# Altium schematic sheet SH-C31A-V1.1.SchDoc
size 420 x 298 mm; Symbol: Sheet-Symbol_A3; Company: DSD TECH; @Page No: 1; @Page Name: P1; @Project Name: CANable; @Page Count: 1; @Update Date: 2023-06-07; @Create Date: 2023-04-24; @Schematic Name: CANable2.0_V1.1; Device: Sheet-Symbol_A3
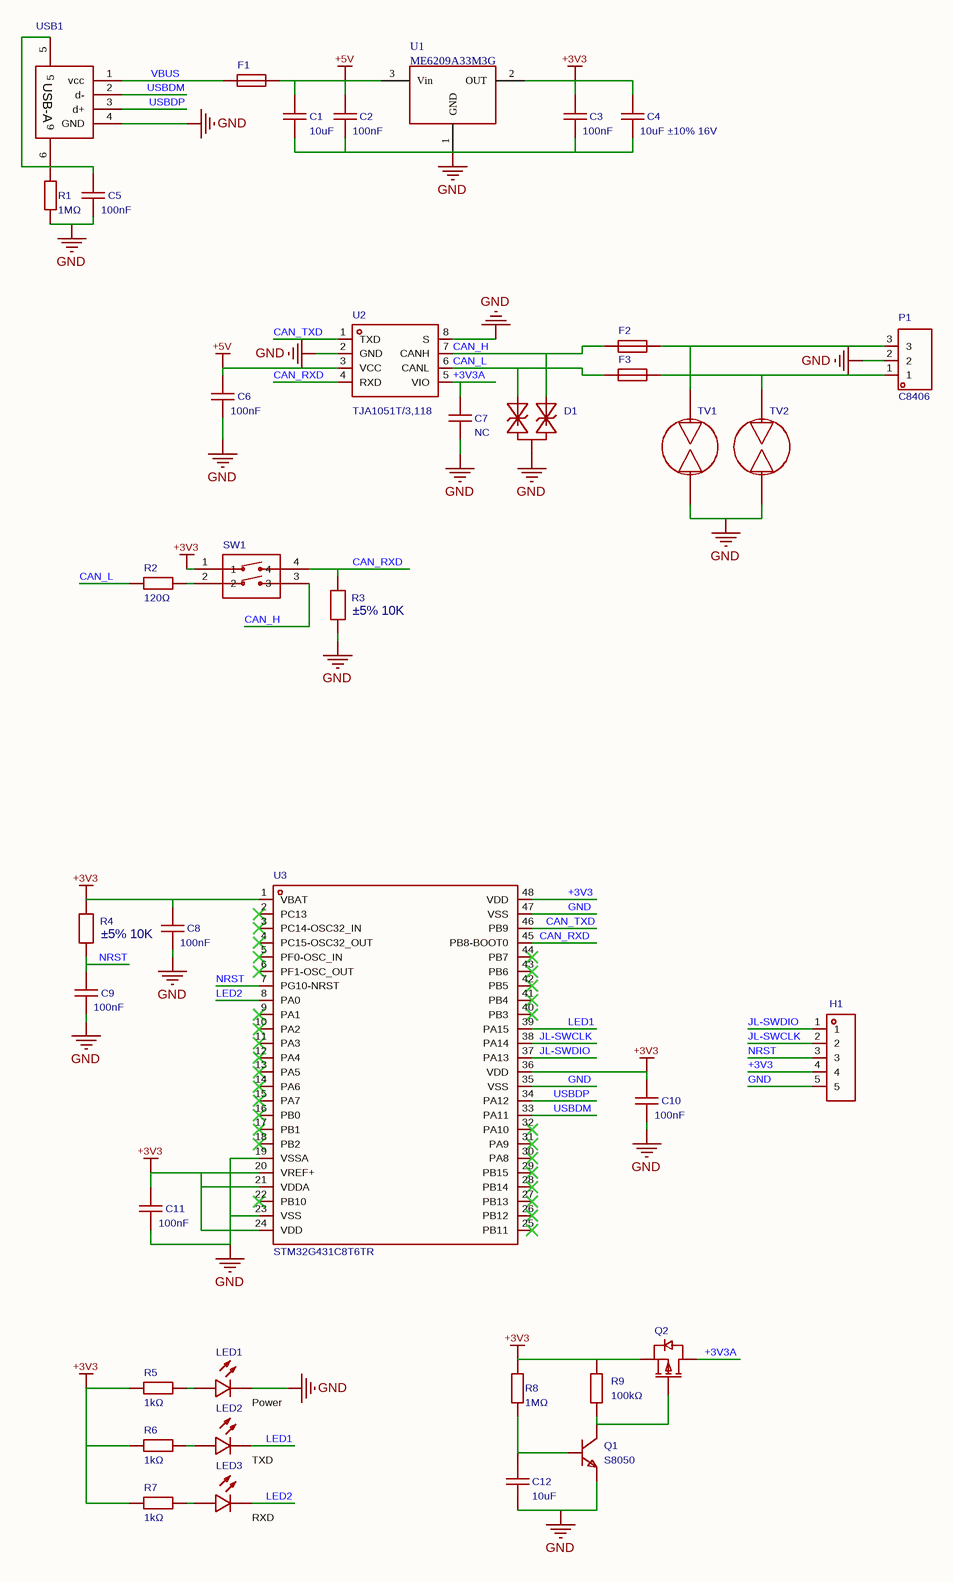
[diagram p0: SH-C31A-V1.1.SchDoc]

## Parts
C1  10uF  [C0805_1]
C2  100nF  [C0402_2]
C3  100nF  [C0402_2]
C4  LCSC Part Name: 10uF ±10% 16V  [C0805_1]  (hidden comment: 10uF)
C5  100nF  [C0402_2]
C6  100nF  [C0402_2]
C7  NC  [C0402_2]
C8  100nF  [C0402_2]
C9  100nF  [C0402_2]
C10  100nF  [C0402_2]
C11  100nF  [C0402_2]
C12  10uF  [C0603_1]
D1  (no value)  [SOT-23-3_L2.9-W1.3-P1.90-LS2.4-BR]
F1  (no value)  [F0805]
F2  SMD1206B020TF/24  [F1206_1]  (value not drawn)
F3  SMD1206B020TF/24  [F1206_1]  (value not drawn)
H1  (no value)  [HDR-TH_5P-P2.54-V-M]
LED1  (no value)  [LED0603-RD_RED_1]
LED2  (no value)  [LED0603-RD]
LED3  (no value)  [LED0603-RD]
P1  Supplier Part: C8406  [CONN-TH_3P-P3.81_WJ15EDGRC-3.81-3P]  (hidden comment: WJ15EDGRC-3.81-3P)
Q1  S8050  [SOT-23_L2.9-W1.3-P1.90-LS2.4-BR]
Q2  SI2301  [SOT-23-3_L2.9-W1.3-P1.90-LS2.4-BR_2]  (value not drawn)
R1  value 1MΩ  [R0603]
R2  value 120Ω  [R0805]
R3  LCSC Part Name: ±5% 10K  [R0402]
R4  LCSC Part Name: ±5% 10K  [R0402]
R5  value 1kΩ  [R0402]
R6  value 1kΩ  [R0402]
R7  value 1kΩ  [R0402]
R8  value 1MΩ  [R0603]
R9  100kΩ  [R0603]
SW1  (no value)  [SW-SMD_4P-L6.5-W6.0-P2.54-LS9.8]
TV1  (no value)  [DIO-DT-SMD_L4.5-W3.2]
TV2  (no value)  [DIO-DT-SMD_L4.5-W3.2]
U1  ME6209A33M3G  [SOT-23(SOT-23-3)]
U2  TJA1051T/3,118  [SOIC-8_L4.9-W3.9-P1.27-LS6.0-BL]
U3  STM32G431C8T6TR  [LQFP-48_L7.0-W7.0-P0.50-LS9.0-BL_1]
USB1  (no value)  [USB-A-SMD_U-G-04WS-W-01]

## Nets
+3V3: C3.2 C4.2 C8.2 C10.2 C11.2 H1.4 Q2.2(S) R4.2 R5.1 R6.1 R7.1 R8.2 R9.2 SW1.1 U1.2(OUT) U3.1(VBAT) U3.20(VREF+) U3.21(VDDA) U3.24(VDD) U3.36(VDD) U3.48(VDD)
+5V: C1.2 C2.2 C6.2 F1.2 U1.3(Vin) U2.3(VCC)
GND: C1.1 C2.1 C3.1 C4.1 C5.1 C6.1 C7.1 C8.1 C9.1 C10.1 C11.1 C12.1 D1.3 H1.5 LED1.1(K) P1.2 Q1.2(E) R1.1 R3.1 TV1.2 TV2.2 U1.1(GND) U2.2(GND) U2.8(S) U3.19(VSSA) U3.23(VSS) U3.35(VSS) U3.47(VSS) USB1.4(GND)
+3V3A: C7.2 Q2.3(D) U2.5(VIO)
CAN_H: D1.1 F2.1 SW1.3 U2.7(CANH)
CAN_L: D1.2 F3.1 R2.1 U2.6(CANL)
CAN_RXD: R3.2 SW1.4 U2.4(RXD) U3.45(PB8-BOOT0)
CAN_TXD: U2.1(TXD) U3.46(PB9)
JL-SWCLK: H1.2 U3.38(PA14)
JL-SWDIO: H1.1 U3.37(PA13)
LED1: LED2.1(K) U3.39(PA15)
LED2: LED3.1(K) U3.8(PA0)
NRST: C9.2 H1.3 R4.1 U3.7(PG10-NRST)
USBDM: U3.33(PA11) USB1.2(d-)
USBDP: U3.34(PA12) USB1.3(d+)
VBUS: F1.1 USB1.1(vcc)
NetC5_2: C5.2 R1.2 USB1.5 USB1.6
NetC12_2: C12.2 Q1.1(B) R8.1
NetF2_2: F2.2 P1.3 TV1.1
NetF3_2: F3.2 P1.1 TV2.1
NetLED1_2: LED1.2(A) R5.2
NetLED2_2: LED2.2(A) R6.2
NetLED3_2: LED3.2(A) R7.2
NetQ1_3: Q1.3(C) Q2.1(G) R9.1
NetR2_2: R2.2 SW1.2

Not connected (* = marked no-connect by the designer): U3 2(PC13)* 3(PC14-OSC32_IN)* 4(PC15-OSC32_OUT)* 5(PF0-OSC_IN)* 6(PF1-OSC_OUT)* 9(PA1)* 10(PA2)* 11(PA3)* 12(PA4)* 13(PA5)* 14(PA6)* 15(PA7)* 16(PB0)* 17(PB1)* 18(PB2)* 22(PB10)* 25(PB11)* 26(PB12)* 27(PB13)* 28(PB14)* 29(PB15)* 30(PA8)* 31(PA9)* 32(PA10)* 40(PB3)* 41(PB4)* 42(PB5)* 43(PB6)* 44(PB7)*

## Notes on the sheet
- (near LED1) Power
- (near LED2) TXD
- (near LED3) RXD
- Update Date
- 2023-06-07
- Schematic
- Page
- CANable2.0_V1.1
- P1
- Create Date
- Part Number
- 2023-04-24
- Reviewed
- Drawed
- CANable
- VER
- SIZE
- PAGE
- 1
- DSD TECH
- OF
- (in symbol U-G-04WS-W-01) USB-A

## Library data of the parts
C1 C4 = CL21A106KOQNNNE: Capacitance:10uF;Tolerance:±10%;Rated Voltage:16V;Dielectric (Temp. Coefficient):X5R;; Manufacturer: SAMSUNG; AddInBom: yes; ModelId: 1ba041120af144c991958decab20d241; ModelName: C0805_L2.0-W1.3-H1.3; ModelTransform: 78.74,51.181,0,0,0,0,0,0.0005,0; Tolerance: ±10%; Voltage Rated: 16V; Temperature Coefficient: X5R; Symbol: CL21A106KOQNNNE; Value: 10uF; Device: CL21A106KOQNNNE; SupplierPart: C1713; ManufacturerPart: CL21A106KOQNNNE; Supplier Footprint: 0805; JLCPCB Part Class: Extended Part; Datasheet: https://atta.szlcsc.com/upload/public/pdf/source/20160103/1457707694240.pdf; Supplier: LCSC; ConvertToPcb: yes; FootprintName: C0805_1
  C1: LCSC Part Name: 10uF ±10% 16V
C2 C3 C5 C6 C8-C11 = 0402B104K250NT: Capacitance:100nF;Tolerance:±10%;Rated Voltage:25V;Dielectric (Temp. Coefficient):X7R;; Manufacturer: FH; AddInBom: yes; ModelId: 36a51122f27c49738f86b3bfa98863e0; ModelName: C0402_L1.0-W0.5-H0.5; ModelTransform: 39.37,19.685,0,0,0,0,0,0,0; Tolerance: ±10%; Voltage Rated: 25V; Temperature Coefficient: X7R; Symbol: 0402B104K250NT; Value: 100nF; Device: 0402B104K250NT; LCSC Part Name: 100nF ±10% 25V; SupplierPart: C56392; ManufacturerPart: 0402B104K250NT; Supplier Footprint: 0402; JLCPCB Part Class: Extended Part; Datasheet: https://atta.szlcsc.com/upload/public/pdf/source/20170923/C56392_1506149493292988842.pdf; Supplier: LCSC; ConvertToPcb: yes; FootprintName: C0402_2
C7 = 0402B104K250NT: Capacitance:100nF;Tolerance:±10%;Rated Voltage:25V;Dielectric (Temp. Coefficient):X7R;; Manufacturer: FH; Value: 100nF; AddInBom: yes; ModelId: 36a51122f27c49738f86b3bfa98863e0; ModelName: C0402_L1.0-W0.5-H0.5; ModelTransform: 39.37,19.685,0,0,0,0,0,0,0; Tolerance: ±10%; Voltage Rated: 25V; Temperature Coefficient: X7R; Symbol: 0402B104K250NT; Device: 0402B104K250NT; LCSC Part Name: 100nF ±10% 25V; SupplierPart: C56392; ManufacturerPart: 0402B104K250NT; Supplier Footprint: 0402; JLCPCB Part Class: Extended Part; Datasheet: https://atta.szlcsc.com/upload/public/pdf/source/20170923/C56392_1506149493292988842.pdf; Supplier: LCSC; ConvertToPcb: yes; FootprintName: C0402_2
C12 = CL10A106KP8NNNC: Capacitance:10uF;Tolerance:±10%;Rated Voltage:10V;Dielectric (Temp. Coefficient):X5R;; Manufacturer: SAMSUNG; AddInBom: yes; ModelId: ac125912035d415993ca9572d50418b1; ModelName: C0603_L1.6-W0.8-H0.8; ModelTransform: 62.992,31.496,0,0,0,0,0,0,0; Tolerance: ±10%; Voltage Rated: 10V; Temperature Coefficient: X5R; Symbol: CL10A106KP8NNNC; Value: 10uF; Device: CL10A106KP8NNNC; LCSC Part Name: 10uF ±10% 10V; SupplierPart: C19702; ManufacturerPart: CL10A106KP8NNNC; Supplier Footprint: 0603; JLCPCB Part Class: Basic Part; Datasheet: https://atta.szlcsc.com/upload/public/pdf/source/20160103/1457707703378.pdf; Supplier: LCSC; ConvertToPcb: yes; FootprintName: C0603_1
D1 = TPPESD12VL2BT: Manufacturer: TECH PUBLIC; AddInBom: yes; ModelId: c62791f0466c4ae2a892c056b845b0ca; ModelName: SOT-23-3P_L2.9-W1.3-H1.0-LS2.4-P0.95; ModelTransform: 98.425,114.173,0,180,0,0,0.0005,-0.0005,0; Symbol: TPPESD12VL2BT; Device: TPPESD12VL2BT; LCSC Part Name: TPPESD12VL2BT; SupplierPart: C2682273; ManufacturerPart: TPPESD12VL2BT; Supplier Footprint: SOT-23-3; JLCPCB Part Class: Extended Part; Datasheet: https://atta.szlcsc.com/upload/public/pdf/source/20210810/22D0EE7AE03C1C968B9C50DDF599EB08.pdf; Supplier: LCSC; ConvertToPcb: yes; FootprintName: SOT-23-3_L2.9-W1.3-P1.90-LS2.4-BR
F1 = FSMD010-24-0805-R: Max Voltage:24V;Max Current:100A;Hold Current:100mA;Trip Current:300mA;; Manufacturer: FUZETEC; AddInBom: yes; ModelId: 57e2aa106f9143e8b6ab832aebb31c78; ModelName: F0805_L2.1-W1.4-H0.8; ModelTransform: 82.677,55.118,0,0,0,0,0.0005,0,0; Operating Voltage (Max): 24V; Current Rating (Max): 100A; Hold Current: 100mA; Trip Current: 300mA; Symbol: FSMD010-24-0805-R; Device: FSMD010-24-0805-R; LCSC Part Name: 0.1A 24V resettable fuse; SupplierPart: C220142; ManufacturerPart: FSMD010-24-0805-R; Supplier Footprint: 0805; JLCPCB Part Class: Extended Part; Datasheet: https://atta.szlcsc.com/upload/public/pdf/source/20180530/C220142_CDCC5931C174CCAFFDB29D784E09FABB.PDF; Supplier: LCSC; ConvertToPcb: yes; FootprintName: F0805
F2 F3 = SMD1206B020TF/24: Max Voltage:24V;Max Current:100A;Hold Current:200mA;Trip Current:420mA;Max Trip Time:100ms;; Manufacturer: Brightking; AddInBom: yes; ModelId: f1628daad26847a79b887277a2bc8541; ModelName: F1206_L3.2-W1.7-H0.6; ModelTransform: 125.984,66.929,0,0,0,0,0,0,0; Operating Voltage (Max): 24V; Current Rating (Max): 100A; Hold Current: 200mA; Trip Current: 420mA; Maximum Time to Trip: 100ms; Symbol: SMD1206B020TF/24; Device: SMD1206B020TF/24; LCSC Part Name: 24VDC 0.2A; SupplierPart: C269111; ManufacturerPart: SMD1206B020TF/24; Supplier Footprint: SMD; JLCPCB Part Class: Extended Part; Datasheet: https://atta.szlcsc.com/upload/public/pdf/source/20180817/C269111_B76553ADDD05C0EABB0A26C6D9A96E77.pdf; Supplier: LCSC; ConvertToPcb: yes; FootprintName: F1206_1
H1 = PZ254V-11-05P: Pitch:2.54mm;Total Pins:5;Rows:1;Pin Configuration:1x5P;Row Spacing:-;Mounting Type:Through Hole;Round Pin/Square Pin:Square Pin;Rated Current:-;Rated Voltage:-;Mating Pin Length:6mm;Insulator Height:2.5mm;Termination Pin Length:3mm;Contact Material:Brass;Contact Plating:-;Operating Temp. Range:-40~+105;Color:Black;; Manufacturer: XFCN; AddInBom: yes; ModelId: 47d466e4a34f4fc5bc626cf773a24dd5; ModelName: HDR-TH_5P-P2.54-M-LI-1X5P; ModelTransform: 499.999,100,0,0,0,0,0,0,-118.11; Pitch: 2.54mm; Pin Structure: 1x5P; Symbol: PZ254V-11-05P; Operating Temperature Range: -40~+105; Device: PZ254V-11-05P; LCSC Part Name: 2.54mm 1x5P; SupplierPart: C492404; ManufacturerPart: PZ254V-11-05P; Supplier Footprint: Through Hole,P=2.54mm; JLCPCB Part Class: Extended Part; Datasheet: https://atta.szlcsc.com/upload/public/pdf/source/20200309/C492404_E51533260F8710EFF5D4617281164C1D.pdf; Supplier: LCSC; ConvertToPcb: yes; FootprintName: HDR-TH_5P-P2.54-V-M; Number of Pins: 5; Number of Rows: 1; Row Spacing: -; Mounting Type: Through Hole; Circluar Pins/Square Pins: Square Pin; Current Rating (Max): -; Voltage Rating (Max): -; Length of Mating Pin: 6mm; Insulation Height: 2.5mm; Length of End Connection Pin: 3mm; Contact Material: Brass; Contact Plating: -; Color: Black
LED1 = NCD0603R1_C84263: Emitted Color:Red;; Manufacturer: NationStar; Symbol: FC-DA1608HRK-620D_1; AddInBom: yes; ModelId: 74041d3a270d435c8600a9ab9b7641c0; ModelName: LED0603-RD_RED; ModelTransform: 63.7794,31.496,0,0,0,0,0,0,0; Emitted Color: Red; Device: NCD0603R1_C84263; LCSC Part Name: Red; SupplierPart: C84263; ManufacturerPart: NCD0603R1; Supplier Footprint: 0603; JLCPCB Part Class: Extended Part; Datasheet: https://atta.szlcsc.com/upload/public/pdf/source/20200820/C84263_DABC6A75E58F576973B407FDBA283D60.pdf; Supplier: LCSC; ConvertToPcb: yes; FootprintName: LED0603-RD_RED_1
LED2 LED3 = NCD0603G1: Emitted Color:Emerald Green;; Manufacturer: NationStar; Symbol: FC-D1608UGK-520D10; AddInBom: yes; ModelId: 1f0d29a91be547639d425604e9b96ebb; ModelTransform: 63.7794,32.283,0,0,0,0,0,0,0; Device: NCD0603G1; LCSC Part Name: Emerald Green; SupplierPart: C84267; ManufacturerPart: NCD0603G1; Supplier Footprint: 0603; JLCPCB Part Class: Extended Part; Datasheet: https://atta.szlcsc.com/upload/public/pdf/source/20200820/C84267_04BA7703640BAC111D09F5EFB971FBF3.pdf; Supplier: LCSC; ConvertToPcb: yes; FootprintName: LED0603-RD; ModelName: LED0603-RD; Emitted Color: Emerald Green
P1 = WJ15EDGRC-3.81-3P: Connector Type:Board-side receptacle, closed;Configuration:1x3P;Pitch:3.81mm;Rows:1;Pins per Row:3;Mounting:Right-angle;Color:Green;; Manufacturer: KANGNEX; AddInBom: yes; ModelId: 215c5d990bbb48d2b14dda54b8345e7b; ModelName: CONN-TH_3P_L12.3-W9.2-H7.0-P3.81; ModelTransform: 484.6447,360.2355,0,0,0,0,0,-118.11,-137.795; Structure: 1x3P; Pitch: 3.81mm; Number of PINs Per Row: 3; Symbol: WJ15EDGRC-3.81-3P; Device: WJ15EDGRC-3.81-3P; LCSC Part Name: Board-side receptacle, closed 1x3P 3.81mm Rows:1 Pins per Row:3 Right-angle; ManufacturerPart: WJ15EDGRC-3.81-3P; Supplier Footprint: Right-angle through hole,P=3.81mm; JLCPCB Part Class: Extended Part; Datasheet: https://atta.szlcsc.com/upload/public/pdf/source/20191225/C8406_B27C5DC97AFF46E3E6AAC690B6FE6CCE.pdf; Supplier: LCSC; ConvertToPcb: yes; FootprintName: CONN-TH_3P-P3.81_WJ15EDGRC-3.81-3P; Connector Type: Board-side receptacle, closed; Number of Rows: 1; Mounting Style: Right-angle; Color: Green
Q1 = S8050_C444723: Transistor Type:NPN;Collector-Emitter Breakdown Voltage(Vceo):25V;Collector Current(Ic):500mA;Power(Pd):300mW;Collector-Emitter Saturation Voltage(VCE(sat)@Ic,Ib):600mV@500mA,50mA;DC Current Gain(hFE@Ic,Vce):-;Transition Frequency(fT):150MHz;Operating Temp.:+150℃@(Tj);; Manufacturer: Slkor; AddInBom: yes; ModelId: c62791f0466c4ae2a892c056b845b0ca; ModelName: SOT-23-3P_L2.9-W1.3-H1.0-LS2.4-P0.95; ModelTransform: 98.64468,114.173,0,180,0,0,0,0,0; Transistor Type: NPN; Collector-Emitter Breakdown Voltage (Vceo): 25V; Collector Current (Ic): 500mA; Power Dissipation (Pd): 300mW; Transition Frequency (fT): 150MHz; Symbol: S8050_C444723; Manufacturer Part: S8050; Device: S8050_C444723; LCSC Part Name: S8050SOT-23 SOT-23; SupplierPart: C444723; Supplier Footprint: SOT-23; JLCPCB Part Class: Extended Part; Datasheet: https://atta.szlcsc.com/upload/public/pdf/source/20191106/C444723_63F3CBA9B7EFAA36D3929F9CC524D030.pdf; Supplier: LCSC; ConvertToPcb: yes; FootprintName: SOT-23_L2.9-W1.3-P1.90-LS2.4-BR; Collector-Emitter Saturation Voltage (VCE(sat)@Ic,Ib): 600mV@500mA,50mA; DC Current Gain (hFE@Ic,Vce): -; Operating Temperature: +150℃@(Tj)
Q2 = SI2301_C2891731: Type:P-channel;Drain-Source Voltage(Vdss):20V;Continuous Drain Current(Id):2.2A;Power(Pd):700mW;On-Resistance(RDS(on)@Vgs,Id):90mΩ@4.5V,1.5A;Threshold Voltage(Vgs(th)@Id):620mV@250uA;Operating Temp.:+150℃@(Tj);; Manufacturer: YONGYUTAI; AddInBom: yes; ModelId: c62791f0466c4ae2a892c056b845b0ca; ModelName: SOT-23-3P_L2.9-W1.3-H1.0-LS2.4-P0.95; ModelTransform: 98.425,114.173,0,180,0,0,0.0005,-0.0005,0; Drain Source Voltage (Vdss): 20V; Continuous Drain Current (Id): 2.2A; Power Dissipation (Pd): 700mW; Symbol: SI2301_C2891731; Device: SI2301_C2891731; LCSC Part Name: P-channel 20V 2.2A; SupplierPart: C2891731; ManufacturerPart: SI2301; Supplier Footprint: SOT-23; JLCPCB Part Class: Extended Part; Datasheet: https://atta.szlcsc.com/upload/public/pdf/source/20210901/BD7F488CADB80954861F21BEE026F08A.pdf; Supplier: LCSC; ConvertToPcb: yes; FootprintName: SOT-23-3_L2.9-W1.3-P1.90-LS2.4-BR_2; Type: P-channel; Drain Source On Resistance (RDS(on)@Vgs,Id): 90mΩ@4.5V,1.5A; Gate Threshold Voltage (Vgs(th)@Id): 620mV@250uA; Operating Temperature: +150℃@(Tj)
R1 R8 = 0603WAJ0105T5E: Resistor Type:Thick Film Resistor;Resistance:1MΩ;Tolerance:±5%;Power:1/10W;Temp. Coefficient:±100ppm/;Max Working Voltage:75V;Operating Temp. Range:-55~+155;; Manufacturer: UNI-ROYAL; AddInBom: yes; ModelId: 3281a289d46d4bb1877be1eabd090e13; ModelName: R0603_L1.6-W0.8-H0.8; ModelTransform: 62.992,31.496,0,0,0,0,0,0,0; Tolerance: ±5%; Power(Watts): 1/10W; Overload Voltage (Max): 75V; Symbol: 0603WAJ0105T5E; Temperature Coefficient: ±100ppm/; Operating Temperature Range: -55~+155; Device: 0603WAJ0105T5E; LCSC Part Name: 1MΩ ±5%; SupplierPart: C26098; ManufacturerPart: 0603WAJ0105T5E; Supplier Footprint: 0603; JLCPCB Part Class: Extended Part; Datasheet: https://atta.szlcsc.com/upload/public/pdf/source/20200306/C422600_1E6D84923E4A46A82E41ADD87F860B5C.pdf; Supplier: LCSC; ConvertToPcb: yes; FootprintName: R0603; Type: Thick Film Resistor
R2 = TC0525F1200T5E: Resistor Type:Thin Film Resistor;Resistance:120Ω;Tolerance:±1%;Power:250mW;Temp. Coefficient:±25ppm/;Max Working Voltage:150V;Operating Temp. Range:-55~+155;; Manufacturer: UNI-ROYAL; Temperature Coefficient: ±25ppm/; AddInBom: yes; ModelId: 37a81e68749a4138bd2dfa6897b24b85; ModelName: R0805_L2.0-W1.3-H0.6; ModelTransform: 78.74,51.181,0,0,0,0,0,-0.0005,0; Tolerance: ±1%; Power(Watts): 250mW; Overload Voltage (Max): 150V; Symbol: TC0525F1200T5E; Operating Temperature Range: -55~+155; Device: TC0525F1200T5E; LCSC Part Name: 120Ω ±1%; SupplierPart: C61683; ManufacturerPart: TC0525F1200T5E; Supplier Footprint: 0805; JLCPCB Part Class: Extended Part; Datasheet: https://atta.szlcsc.com/upload/public/pdf/source/20190404/C61683_83EF7BF6E2DB2C00969A8D3769A56445.pdf; Supplier: LCSC; ConvertToPcb: yes; FootprintName: R0805; Type: Thin Film Resistor
R3 R4 = SCR0402J10K: Manufacturer: VO; AddInBom: yes; ModelId: 671aefced39d4c318694bba8bd8efd39; ModelName: R0402_L1.0-W0.5-H0.5; ModelTransform: 39.37,19.685,0,0,0,0,0,0.0005,0; Symbol: SCR0402J10K; Device: SCR0402J10K; SupplierPart: C3017497; Supplier Footprint: 0402; JLCPCB Part Class: Extended Part; Datasheet: https://atta.szlcsc.com/upload/public/pdf/source/20220513/247AF9639BA21CF93567DC289CCC6A22.pdf; Supplier: LCSC; ConvertToPcb: yes; FootprintName: R0402
  R3: Manufacturer Part: SCR0402J10K
  R4: ManufacturerPart: SCR0402J10K
R5-R7 = RC0402JR-071KL: Resistance:1kΩ;Tolerance:±5%;Power:1/16W;Temp. Coefficient:±100ppm/;Max Working Voltage:50V;Operating Temp. Range:-55~+155;; Manufacturer: YAGEO; AddInBom: yes; ModelId: 671aefced39d4c318694bba8bd8efd39; ModelName: R0402_L1.0-W0.5-H0.5; ModelTransform: 39.37,19.685,0,0,0,0,0,0.0005,0; Tolerance: ±5%; Power(Watts): 1/16W; Overload Voltage (Max): 50V; Symbol: RC0402JR-071KL; Device: RC0402JR-071KL; Temperature Coefficient: ±100ppm/; Operating Temperature Range: -55~+155; LCSC Part Name: 1kΩ ±5%; SupplierPart: C105637; ManufacturerPart: RC0402JR-071KL; Supplier Footprint: 0402; JLCPCB Part Class: Extended Part; Datasheet: https://atta.szlcsc.com/upload/public/pdf/source/20170518/1495085707603.pdf; Supplier: LCSC; ConvertToPcb: yes; FootprintName: R0402
R9 = 0603WAJ0104T5E: Resistor Type:Thick Film Resistor;Resistance:100kΩ;Tolerance:±5%;Power:100mW;; Manufacturer: UNI-ROYAL; AddInBom: yes; ModelId: fc143cca1e79419f9cd78b61e9279f08; ModelTransform: 31.8897,63.7794,0,90,0,0,0,0,0; Tolerance: ±5%; Power(Watts): 100mW; Temperature Coefficient: ±100ppm/℃; Overload Voltage (Max): 75V; Symbol: 0603WAJ0104T5E; Value: 100kΩ; Device: 0603WAJ0104T5E; LCSC Part Name: 100kΩ ±5% 100mW; SupplierPart: C15458; ManufacturerPart: 0603WAJ0104T5E; Supplier Footprint: 0603; JLCPCB Part Class: Extended Part; Datasheet: https://atta.szlcsc.com/upload/public/pdf/source/20200306/C422600_1E6D84923E4A46A82E41ADD87F860B5C.pdf; Supplier: LCSC; ConvertToPcb: yes; FootprintName: R0603; ModelName: R0603; Type: Thick Film Resistor; Operating Temperature Range: -55℃~+155℃
SW1 = NPM-02-V-T/R: SMD DIP switch, 2.54mm pitch, 2 positions, side-actuated long lever; AddInBom: yes; ModelId: dc9ff7affaf54305afb2aaa1f48b2382; ModelTransform: 255.1176,385.826,0,0,0,0,0,-13.779,0; Symbol: NPM-02-V-T/R; Device: NPM-02-V-T/R; LCSC Part Name: 2-position SMD DIP switch; SupplierPart: C501603; ManufacturerPart: NPM-02-V-T/R; Supplier Footprint: SMD; JLCPCB Part Class: Extended Part; Datasheet: https://atta.szlcsc.com/upload/public/pdf/source/20200324/C501603_F75A0033AA4F50EBB55FC75491E42802.pdf; Supplier: LCSC; ConvertToPcb: yes; FootprintName: SW-SMD_4P-L6.5-W6.0-P2.54-LS9.8; ModelName: SW-SMD_4P-L6.5-W6.0-P2.54-LS9.8
TV1 TV2 = SMD4532-090NF: Electrodes:2;DC Breakdown Voltage:90V;Tolerance:±30%;Pulse Discharge Current:3kA;Interelectrode Capacitance:0.5pF;; Manufacturer: RUILON; AddInBom: yes; ModelId: 3e98048e62f042eda67deea78d2be460; ModelName: DIO-DT_L4.5-W3.2-H2.7; ModelTransform: 177.2,126,0,0,0,0,0,0,0; Number of Poles: 2; DC Spark-over Voltage: 90V; Tolerance: ±30%; Nominal Impulse Discharge Current: 3kA; Maximum Capacitance @ 1MHz: 0.5pF; Symbol: SMD4532-090NF; Device: SMD4532-090NF; LCSC Part Name: 90V; SupplierPart: C9235; ManufacturerPart: SMD4532-090NF; Supplier Footprint: 1812; JLCPCB Part Class: Extended Part; Datasheet: https://atta.szlcsc.com/upload/public/pdf/source/20140725/1457707194440.pdf; Supplier: LCSC; ConvertToPcb: yes; FootprintName: DIO-DT-SMD_L4.5-W3.2
U1 = ME6209A33M3G: ConvertToPcb: yes; Origin Footprint: SOT-23(SOT-23-3); Device: ME6209A33M3G; Symbol: ME6209A33M3G; AddInBom: yes
U2 = TJA1051T/3,118: Type:-;; Manufacturer: NXP; AddInBom: yes; ModelId: e81d2f7d937b4a6ab1dca543ff5d56a4; ModelName: SOIC-8_L4.9-W3.9-H1.7-LS6.0-P1.27; ModelTransform: 189.751,236.22,0,0,0,0,0.0005,0.0005,0; Symbol: TJA1051T/3,118; Manufacturer Part: TJA1051T/3,118; Device: TJA1051T/3,118; LCSC Part Name: TJA1051T/3,118; SupplierPart: C58988; Supplier Footprint: SOIC-8; JLCPCB Part Class: Extended Part; Datasheet: https://atta.szlcsc.com/upload/public/pdf/source/20220802/B41F59DF1B299A7C26D22B2702AC2509.pdf; Supplier: LCSC; ConvertToPcb: yes; FootprintName: SOIC-8_L4.9-W3.9-P1.27-LS6.0-BL; Type: -
U3 = STM32G431C8T6TR: Manufacturer: ST; AddInBom: yes; ModelId: 093be70396ff421eb2cdb946d5311efc; ModelName: LQFP-48_L7.0-W7.0-H1.4-LS9.0-P0.50; ModelTransform: 354.331,354.331,0,0,0,0,0,0,0; Symbol: STM32G431C8T6TR; Manufacturer Part: STM32G431C8T6TR; Device: STM32G431C8T6TR; LCSC Part Name: STM32G431C8T6TR; SupplierPart: C3227259; Supplier Footprint: LQFP-48(7x7); Datasheet: https://atta.szlcsc.com/upload/public/pdf/source/20220721/1CD68AFBB09CF27B558BAB01AF5E1EB5.pdf; Supplier: LCSC; ConvertToPcb: yes; FootprintName: LQFP-48_L7.0-W7.0-P0.50-LS9.0-BL_1
USB1 = U-G-04WS-W-01: Connector Type:Type-A;Standard:USB 2.0;Gender:Male;Contacts:4;Ports:1;; Manufacturer: HRO; AddInBom: yes; ModelId: f6f4a0fb4b8446c28a8faf79888527ee; ModelName: USB-A-SMD_4P-L12.0-W18.8-H4.5-LS12.8; ModelTransform: 499.10806,816.927,0,90,0,0,324.783,0,-98.425; Connector Type: Type-A; Gender: Male; Number of Contacts: 4; Number of Ports: 1; Symbol: U-G-04WS-W-01; Device: U-G-04WS-W-01; LCSC Part Name: Type-A Male; SupplierPart: C97324; ManufacturerPart: U-G-04WS-W-01; Supplier Footprint: SMD; JLCPCB Part Class: Extended Part; Datasheet: https://atta.szlcsc.com/upload/public/pdf/source/20210810/086B58784C0648AAD520661969CA1CDC.pdf; Supplier: LCSC; ConvertToPcb: yes; FootprintName: USB-A-SMD_U-G-04WS-W-01; Standard: USB 2.0